# Altium schematic sheet ESQUEMATICO.SchDoc: RECEPTOR
size A4; DrawnBy: G8; Address1: Yapuyú 197; Address2: Almagro; Address3: CABA; Address4: Argentina; DocumentNumber: .; Revision: 1.0; SheetNumber: 1; SheetTotal: 1; CurrentDate: 11/10
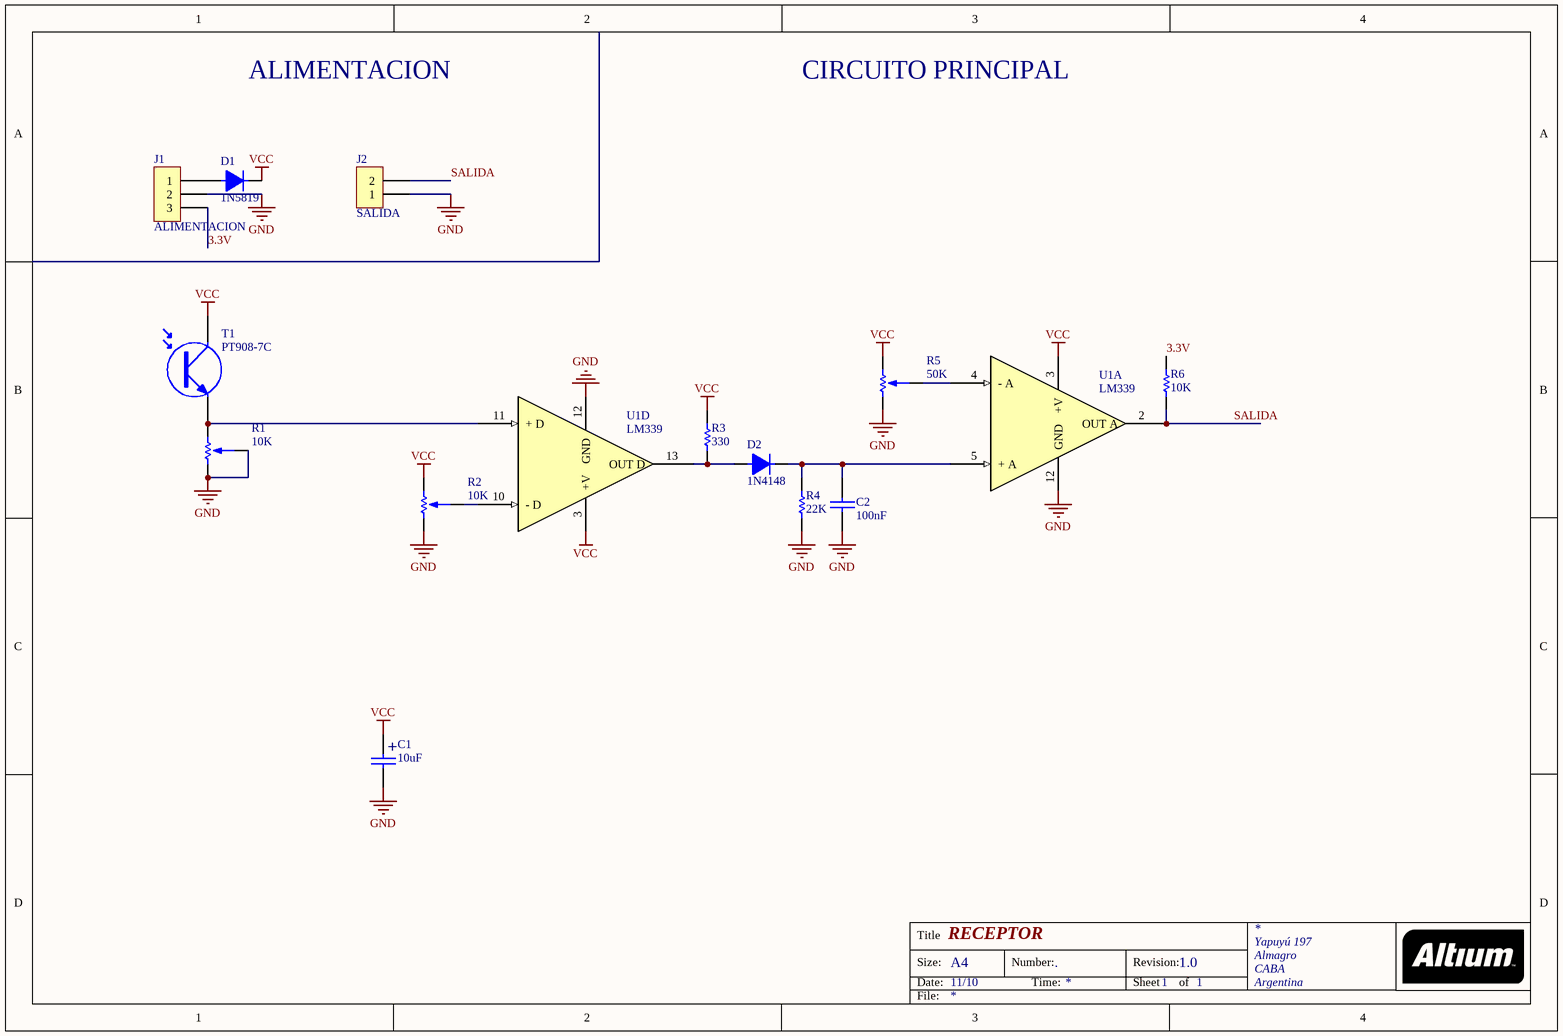
[diagram p0: ESQUEMATICO.SchDoc]

## Parts
C1  10uF  [CAP100RP]
C2  100nF  [CAP200]
D1  1N5819  [DO41]
D2  1N4148  [DO41]
J1  ALIMENTACION  [BORNERA3]
J2  SALIDA  [BORNERA2]
R1  10K  [PRESET V]
R2  10K  [PRESET V]
R3  330  [RES400]
R4  22K  [RES400]
R5  50K  [PRESET V]
R6  10K  [RES400]
T1  PT908-7C  [pototransistor]
U1  LM339  [DIP14]  (parts A,D of 4)

## Nets
GND: C1.2 C2.2 J1.2 J2.1 R1.2 R1.3 R2.3 R4.1 R5.3 U1.12(GND)
VCC: C1.1 D1.2 R2.1 R3.2 R5.1 T1.2(C) U1.3(+V)
3.3V: J1.3 R6.2
SALIDA: J2.2 R6.1 U1.2(OUT_A)
NetC2_1: C2.1 D2.2 R4.2 U1.5(+_A)
NetD1_1: D1.1 J1.1
NetD2_1: D2.1 R3.1 U1.13(OUT_D)
NetR1_1: R1.1 T1.1(E) U1.11(+_D)
NetR2_2: R2.2 U1.10(-_D)
NetR5_2: R5.2 U1.4(-_A)

## Notes on the sheet
- ALIMENTACION
- CIRCUITO PRINCIPAL
- Title
- Size:
- Date:
- A4
- Number:
- Time:
- Revision:
- Sheet
- of
- File:
- (in symbol CAPPOL) +

## Library data of the parts
C1 = CAPPOL
C2 = CAP
D1 D2 = DIODO
J1 = BORNERA 3
J2 = BORNERA 2
R1 R2 R5 = PRESET
R3 R4 R6 = RES
T1 = PT908-7C: fototransistor
U1 = LM339: Comparador Open Collector